# EAGLE design SparkFun_LilyPad_Buzzer (EAGLE 7.2.0)
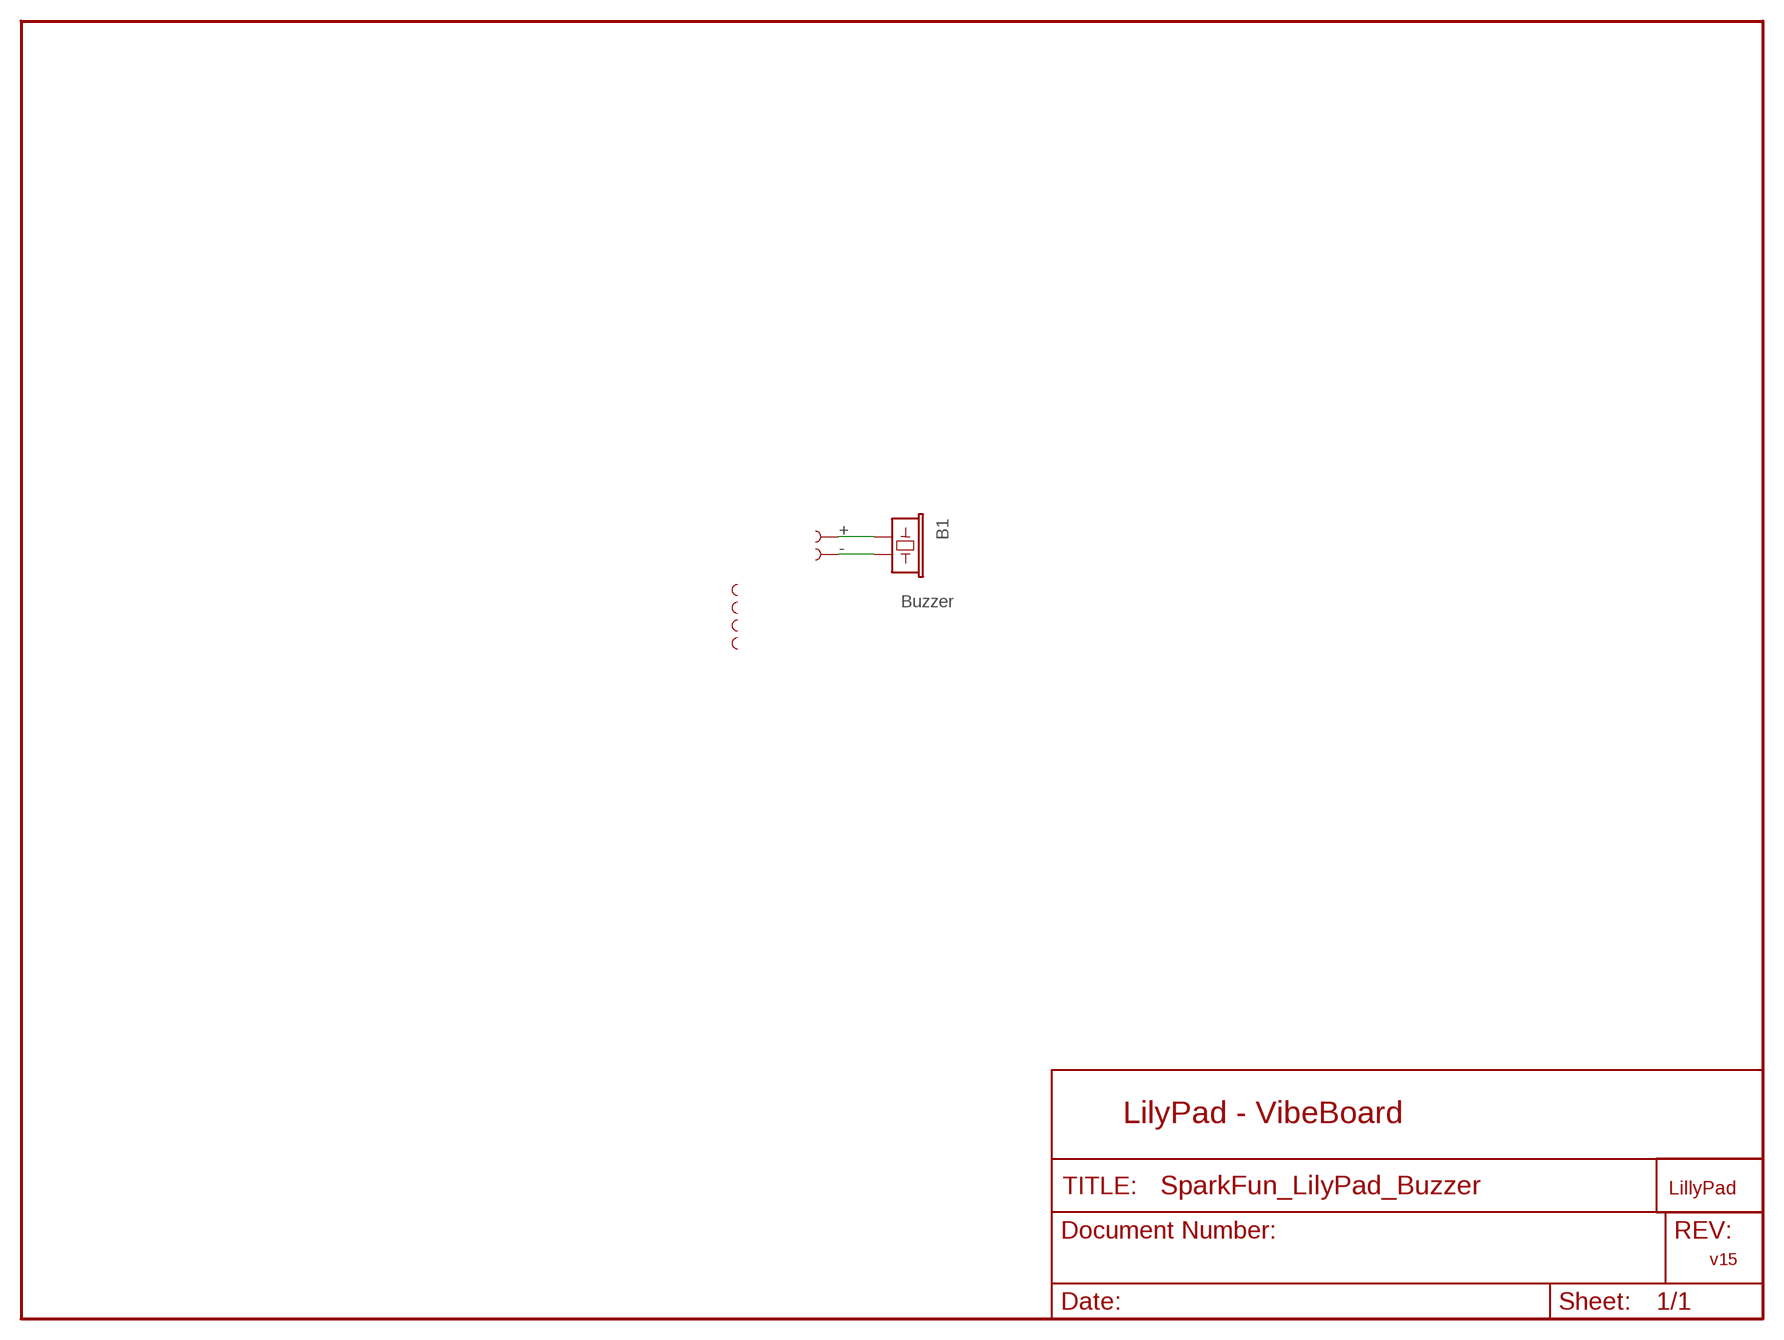
[diagram p0: schematic, sheet 1]

## Parts
B1  Buzzer  BUZZERSMD2  [BUZZER-CCV]
U$1  SEWTAP-NOHOLE2  [PETAL-NOHOLE-2SIDE]
U$2  LOGO-LPLP  [LOGO-LILYPAD]
U$4  SEWTAP-NOHOLE2  [PETAL-NOHOLE-2SIDE]
U$6  SEWTAP-NOHOLE2  [PETAL-NOHOLE-2SIDE]
U$7  SEWTAP-NOHOLE2  [PETAL-NOHOLE-2SIDE]
U$8  SEWTAP6  [PETAL-SMALL-2SIDE]
U$9  SEWTAP6  [PETAL-SMALL-2SIDE]

## Nets
+: B1.+ U$9.1
-: B1.- U$8.1

## Notes on the sheet
- LilyPad - VibeBoard
- v15

## Library data of the parts
B1 = SparkFun:BUZZER: Buzzer 12mm Spark Fun Electronics SKU : Comp-Buzzer
U$1 U$4 U$6 U$7 = LilyPad-Wearables:SEWTAP-NOHOLE
U$2 = LilyPad-Wearables:LOGO-LP
U$8 U$9 = LilyPad-Wearables:SEWTAP

## Board
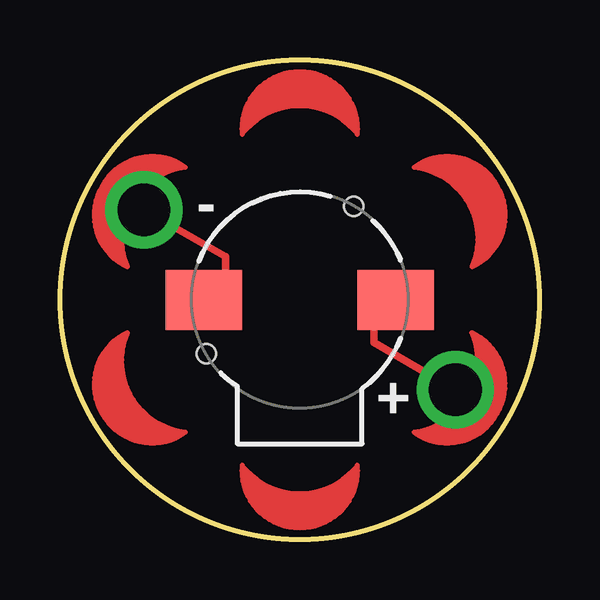
[diagram p1: board, top side]
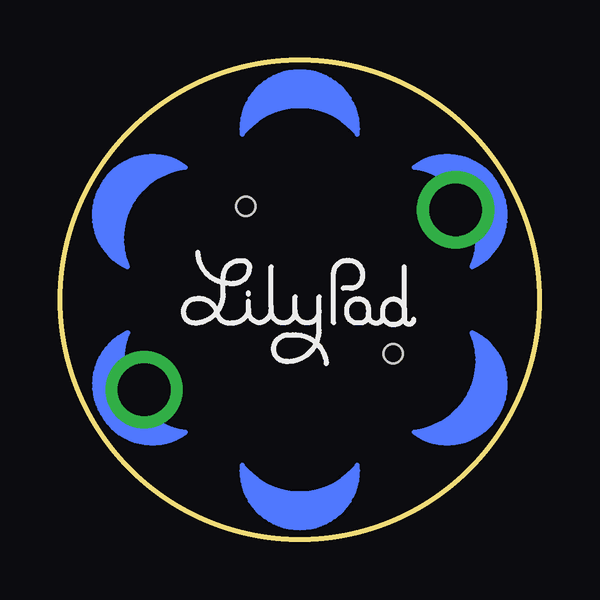
[diagram p2: board, bottom side, seen from below]

Size 20 x 20 mm. Coordinates in mm from the lower left corner, seen from the top.
Outline: circle at 10,10 radius 10
Copper layers (1*16): Top 0.035mm / dielectric 1.5mm / Bottom 0.035mm
Design rules "SparkFun": minimum track width 8mil, minimum drill 20mil, track to track 8mil, track to pad 8mil, pad to pad 8mil, via to via 8mil, smd to smd 8mil, copper to edge 8mil, drill to drill 8mil, minimum pad ring 12mil, minimum via ring 10mil, stop-mask expansion 4mil, vias tented up to drill 20mil, thermal gap 10mil

### Footprints (pad centres in the part's own frame; a part is rotated, then mirrored left to right if it is on the bottom)
BUZZER-CCV = smd 3.2 x 2.5: + 4,0; - -4,0 | hole 0.8: -3.9,-2.25; 2.25,3.9
PETAL-SMALL-2SIDE = drill 2.2: 1 0,0

### Placement (x,y rotation side)
B1  10,10 0 top
U$1  16.5,13.75 120 top
U$2  10,10 0 bottom
U$4  10,17.5 180 top
U$6  10,2.5 0 top
U$7  3.5,6.25 300 top
U$8  3.5,13.75 240 top
U$9  16.49,6.25 60 top

### Tracks (layer width: path | path; a pad name or v marks a point on that pad's centre or on a via)
+
  Top 0.305: U$9.1 13.09,8.22 13.09,10 14.11,10.11 B1.+
-
  Top 0.305: U$8.1 6.91,11.8 6.92,10.01 B1.-

### Text on the board
tPlace: - | +